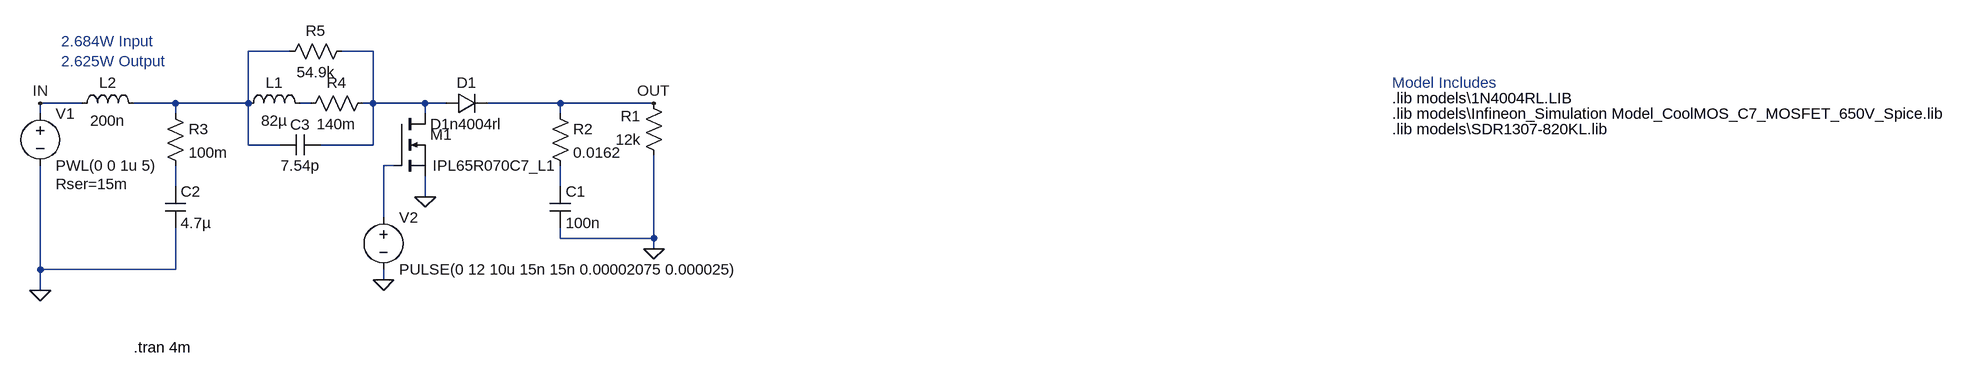
[diagram p0: schematic NewBoost.asc]
NewBoost.asc, the LTspice schematic file:
Version 4
SHEET 1 2884 680
WIRE 272 0 208 0
WIRE 400 0 352 0
WIRE -48 80 -112 80
WIRE 96 80 32 80
WIRE 208 80 208 0
WIRE 208 80 96 80
WIRE 304 80 288 80
WIRE 400 80 400 0
WIRE 400 80 384 80
WIRE 480 80 400 80
WIRE 512 80 480 80
WIRE 688 80 576 80
WIRE 832 80 688 80
WIRE -112 96 -112 80
WIRE 96 96 96 80
WIRE 480 96 480 80
WIRE 688 96 688 80
WIRE 208 144 208 80
WIRE 256 144 208 144
WIRE 400 144 400 80
WIRE 400 144 320 144
WIRE 432 176 416 176
WIRE 96 208 96 176
WIRE 688 208 688 176
WIRE 480 224 480 192
WIRE 416 256 416 176
WIRE 688 288 688 272
WIRE 832 288 832 160
WIRE 832 288 688 288
WIRE 832 304 832 288
WIRE -112 336 -112 176
WIRE 96 336 96 272
WIRE 96 336 -112 336
WIRE 416 352 416 336
WIRE -112 368 -112 336
FLAG -112 368 0
FLAG 832 304 0
FLAG 480 224 0
FLAG 416 352 0
FLAG -112 80 IN
FLAG 832 80 OUT
SYMBOL voltage -112 80 R0
WINDOW 123 0 0 Left 0
WINDOW 39 24 124 Left 2
SYMATTR SpiceLine Rser=15m
SYMATTR InstName V1
SYMATTR Value PWL(0 0 1u 5)
SYMBOL res 848 176 R180
WINDOW 0 36 76 Left 2
WINDOW 3 36 40 Left 2
SYMATTR InstName R1
SYMATTR Value 12k
SYMBOL cap 672 208 R0
SYMATTR InstName C1
SYMATTR Value 100n
SYMBOL diode 512 96 R270
WINDOW 0 32 32 VTop 2
WINDOW 3 0 32 VBottom 2
SYMATTR InstName D1
SYMATTR Value D1n4004rl
SYMBOL nmos 432 96 R0
WINDOW 3 60 80 Left 2
SYMATTR InstName M1
SYMATTR Value IPL65R070C7_L1
SYMATTR Prefix X
SYMBOL voltage 416 240 R0
WINDOW 123 0 0 Left 0
WINDOW 39 0 0 Left 0
SYMATTR InstName V2
SYMATTR Value PULSE(0 12 10u 15n 15n 0.00002075 0.000025)
SYMBOL cap 80 208 R0
SYMATTR InstName C2
SYMATTR Value 4.7µ
SYMBOL res 672 80 R0
SYMATTR InstName R2
SYMATTR Value 0.0162
SYMBOL res 80 80 R0
SYMATTR InstName R3
SYMATTR Value 100m
SYMBOL ind 192 96 R270
WINDOW 0 32 56 VTop 2
WINDOW 3 5 56 VBottom 2
SYMATTR InstName L1
SYMATTR Value 82µ
SYMBOL res 400 64 R90
WINDOW 0 0 56 VBottom 2
WINDOW 3 32 56 VTop 2
SYMATTR InstName R4
SYMATTR Value 140m
SYMBOL cap 320 128 R90
WINDOW 0 0 32 VBottom 2
WINDOW 3 32 32 VTop 2
SYMATTR InstName C3
SYMATTR Value 7.54p
SYMBOL res 368 -16 R90
WINDOW 0 0 56 VBottom 2
WINDOW 3 32 56 VTop 2
SYMATTR InstName R5
SYMATTR Value 54.9k
SYMBOL ind -64 96 R270
WINDOW 0 32 56 VTop 2
WINDOW 3 5 56 VBottom 2
SYMATTR InstName L2
SYMATTR Value 200n
TEXT 1968 96 Left 2 !.lib models\\Infineon_Simulation Model_CoolMOS_C7_MOSFET_650V_Spice.lib
TEXT 32 456 Left 2 !.tran 4m
TEXT -80 -16 Left 2 ;2.684W Input\n2.625W Output
TEXT 1968 72 Left 2 !.lib models\\1N4004RL.LIB
TEXT 1968 48 Left 2 ;Model Includes
TEXT 1968 120 Left 2 !.lib models\\SDR1307-820KL.lib

The netlist it stands for:
* NewBoost.asc
V1 IN 0 PWL(0 0 1u 5) Rser=15m
R1 0 OUT 12k
C1 N006 0 100n
D1 N002 OUT D1n4004rl
XM1 N002 N004 0 IPL65R070C7_L1  ; pins D G S
V2 N004 0 PULSE(0 12 10u 15n 15n 0.00002075 0.000025)
C2 N005 0 4.7µ
R2 OUT N006 0.0162
R3 N001 N005 100m
L1 N001 N003 82µ
R4 N002 N003 140m
C3 N002 N001 7.54p
R5 N002 N001 54.9k
L2 IN N001 200n
.model D D
.lib standard.dio
.lib models\Infineon_Simulation Model_CoolMOS_C7_MOSFET_650V_Spice.lib
.tran 4m
* 2.684W Input
* 2.625W Output
.lib models\1N4004RL.LIB
* Model Includes
.lib models\SDR1307-820KL.lib
.backanno
.end